# Altium schematic sheet LPF.SchDoc
size A4; SheetNumber: 6; SheetTotal: 14; SPICEModelCacheAYWLURAG: <root> / <DocumentId>AYWLURAG</DocumentId> / <CacheFrame Number="0"> / <Model Name="0603_885012206067_22nf" Kind="CKT"> / <Text>******* / .subckt 0603_885012206067_22nF 1 2 / Rser 1 3 0.03101 / Lser 2 4 0.00000000028048 / C1 3 4 0.000000022 / Rpar 3 4 10000000000 / .ends 0603_885012206067_22nF</Text> / </Model> / <Model Name="0603_885012206065_10nf" Kind="CKT"> / <Text>******* / .subckt 0603_885012206065_10nF 1 2 / Rser 1 3 0.05893 / Lser 2 4 0.00000000037916 / C1 3 4 0.00000001 / Rpar 3 4 10000000000 / .ends 0603_885012206065_10nF</Text> / </Model> / </CacheFrame> / </root>
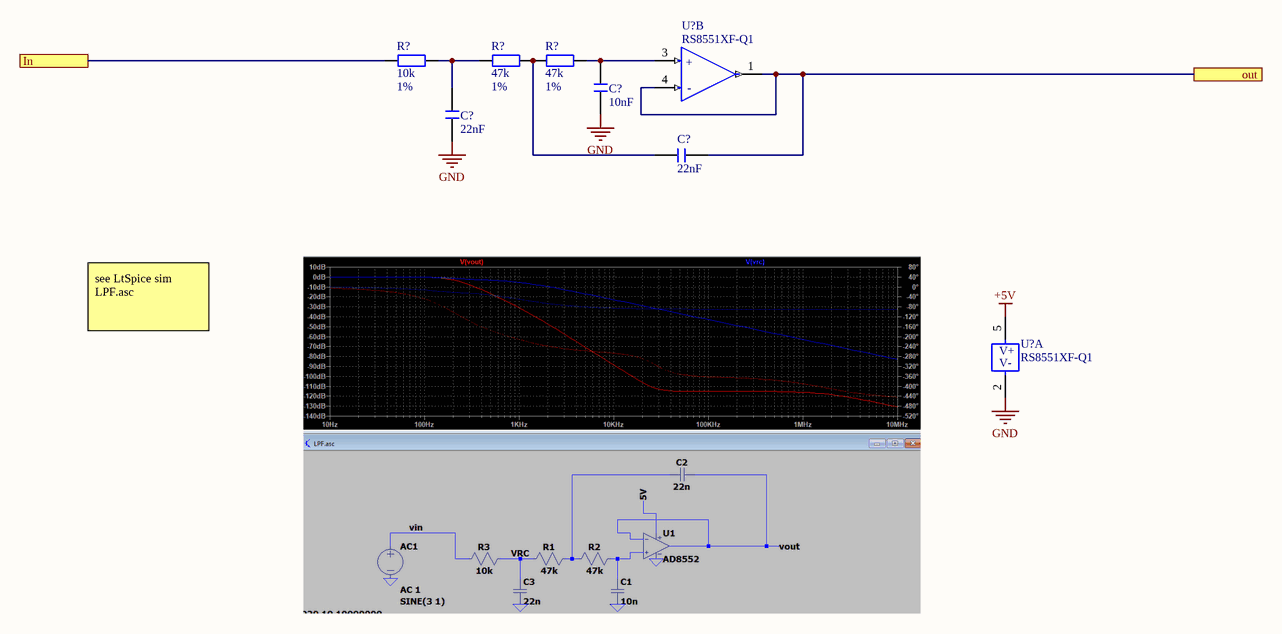
[diagram p0: LPF.SchDoc]

## Parts
(Parts that share a designator on the sheet are numbered #1, #2 ... from top to bottom, then left to right.)
C?#1  value 10nF  [WCAP-CSGP_0603_L1.6W0.8H0.8_Reflow]  (hidden comment: 885012206065)
C?#2  value 22nF  [WCAP-CSGP_0603_L1.6W0.8H0.8_Reflow]  (hidden comment: 885012206067)
C?#3  value 22nF  [WCAP-CSGP_0603_L1.6W0.8H0.8_Reflow]  (hidden comment: 885012206067)
R?#1  value 10k  Tolerance: 1%  [SMD_0603_RES]  (hidden comment: ERJ-3EKF1002V)
R?#2  value 47k  Tolerance: 1%  [SMD_0603_RES]  (hidden comment: ERJ-3EKF4702V)
R?#3  value 47k  Tolerance: 1%  [SMD_0603_RES]  (hidden comment: ERJ-3EKF4702V)
U?#1  RS8551XF-Q1  [TI-SOT23-5_DBV0005A]  (part B of 2)
U?#2  RS8551XF-Q1  [TI-SOT23-5_DBV0005A]  (part A of 2)

## Ports
In, out

## Nets
+5V: U?#2.5(V+)
GND: C?#1.1 C?#2.1 U?#2.2(V-)
In: R?#1.1 ; port In
out: C?#3.1 U?#1.1(OUT) U?#1.4(-IN) ; port out
NetC?#1_2: C?#1.2 R?#3.2 U?#1.3(+IN)
NetC?#2_2: C?#2.2 R?#1.2 R?#2.1
NetC?#3_2: C?#3.2 R?#2.2 R?#3.1

## Notes on the sheet
- see LtSpice sim
  LPF.asc
- (in symbol CMP-014-00026-A01, part B) +; -

## Library data of the parts
C?#1 = CMP-001-00736-4: WCAP-CSGP Multilayer Ceramic Chip Capacitor, General Purpose, size 0603, X7R, 10nF, 25VDC; Manufacturer: Wurth Elektronik; Capacitance Tolerance: +/-10%; Rated Voltage (DC): 25V; Technical Reference: X7R0603103K025DFCT10000; Insulation Resistance: 10GO; Dissipation Factor: 3.5%; ComponentLink1Description: Website Link; Category: Multilayer Ceramic Chip Capacitors; Component Type: Standard; Operating Temperature Min: -55°C; Operating Temperature Max: 125°C; Height: 0.8mm; Case/Package: 0603; Ceramic Type: X7R; ComponentLink2Description: Datasheet Link; Mount: Surface Mount; Pins: 2; Match Code: WCAP-CSGP; Manufacturer Part Number: 885012206065; ComponentLink1URL: https://www.we-online.com/redexpert/article/885012206065?ad; Length: 1.6mm; ComponentLink2URL: https://www.we-online.com/redexpert/spec/885012206065?ad; Width: 0.8mm; Design Item ID: 885012206065; Packaging: Tape and Reel; Source: WCAP-CSGP.SchLib
C?#2 C?#3 = CMP-001-00738-4: WCAP-CSGP Multilayer Ceramic Chip Capacitor, General Purpose, size 0603, X7R, 22nF, 25VDC; Manufacturer: Wurth Elektronik; Capacitance Tolerance: +/-10%; Dissipation Factor: 3.5%; Technical Reference: X7R0603223K025DFCT10000; Rated Voltage (DC): 25V; Insulation Resistance: 10GO; Operating Temperature Min: -55°C; ComponentLink2Description: Datasheet Link; ComponentLink2URL: https://www.we-online.com/redexpert/spec/885012206067?ad; Design Item ID: 885012206067; Operating Temperature Max: 125°C; ComponentLink1URL: https://www.we-online.com/redexpert/article/885012206067?ad; Manufacturer Part Number: 885012206067; Width: 0.8mm; Height: 0.8mm; Pins: 2; Mount: Surface Mount; Case/Package: 0603; Length: 1.6mm; ComponentLink1Description: Website Link; Component Type: Standard; Ceramic Type: X7R; Packaging: Tape and Reel; Match Code: WCAP-CSGP; Source: WCAP-CSGP.SchLib; Category: Multilayer Ceramic Chip Capacitors
R?#1 = CMP-009-07799-A10: RES SMD 10K OHM 1% 1/10W 0603 ±100ppm/°C; Voltage Rating: 75V; Power: 100mW; Pins: 2; RoHS Compliant: Yes; Temperature Coefficient: ±100ppm/°C; Operating Temperature (Min): -55°C; Mounting Technology: SMT; Case/Package: 0603; Operating Temperature (Max): 125°C
R?#2 R?#3 = CMP-009-08189-A11: RES SMD 47K OHM 1% 1/10W 0603 ±100ppm/°C; Voltage Rating: 75V; Power: 100mW; RoHS Compliant: Yes; Operating Temperature (Min): -55°C; Temperature Coefficient: ±100ppm/°C; Pins: 2; Case/Package: 0603; Operating Temperature (Max): 125°C; Mounting Technology: SMT
U?#1 U?#2 = CMP-014-00026-A01: Supply Voltage (Min): 2.7V; Channels: 1; Nominal Gain Bandwidth Product: 4.3Hz; Supply Voltage (Max): 5.5V; Output Type: R2R; Supply Voltage (Nom): 5V; Frequency: 4.3MHz; Case/Package: SOT23-5; Operating Temperature (Max): 125°C; Operating Temperature (Min): -40°C; RoHS Compliant: Yes; Mounting Technology: SMT; Pins: 5